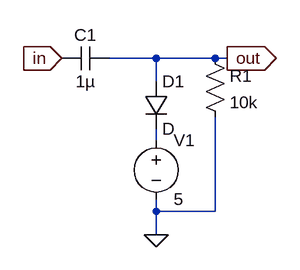
[diagram p0: schematic clamper.asc]
clamper.asc, the LTspice schematic file:
Version 4.1
SHEET 1 940 680
WIRE -80 64 -96 64
WIRE 32 64 -32 64
WIRE 112 64 32 64
WIRE 128 64 112 64
WIRE 32 96 32 64
WIRE 32 176 32 160
WIRE 32 272 32 256
WIRE 112 272 112 144
WIRE 112 272 32 272
WIRE 32 304 32 272
FLAG 128 64 out
IOPIN 128 64 Out
FLAG 32 304 0
FLAG -96 64 in
IOPIN -96 64 In
SYMBOL diode 16 96 R0
SYMATTR InstName D1
SYMBOL cap -32 48 R90
WINDOW 0 0 32 VBottom 2
WINDOW 3 32 32 VTop 2
SYMATTR InstName C1
SYMATTR Value 1µ
SYMBOL voltage 32 160 R0
WINDOW 123 0 0 Left 0
WINDOW 39 0 0 Left 0
SYMATTR InstName V1
SYMATTR Value 5
SYMBOL res 96 48 R0
SYMATTR InstName R1
SYMATTR Value 10k

The netlist it stands for:
* clamper.asc
D1 out N001 D
C1 out in 1µ
V1 N001 0 5
R1 out 0 10k
.model D D
.lib standard.dio
.backanno
.end